# Altium schematic sheet PotsDuino.SchDoc
size A4; DocumentNumber: 1; SheetNumber: 1; SheetTotal: 2
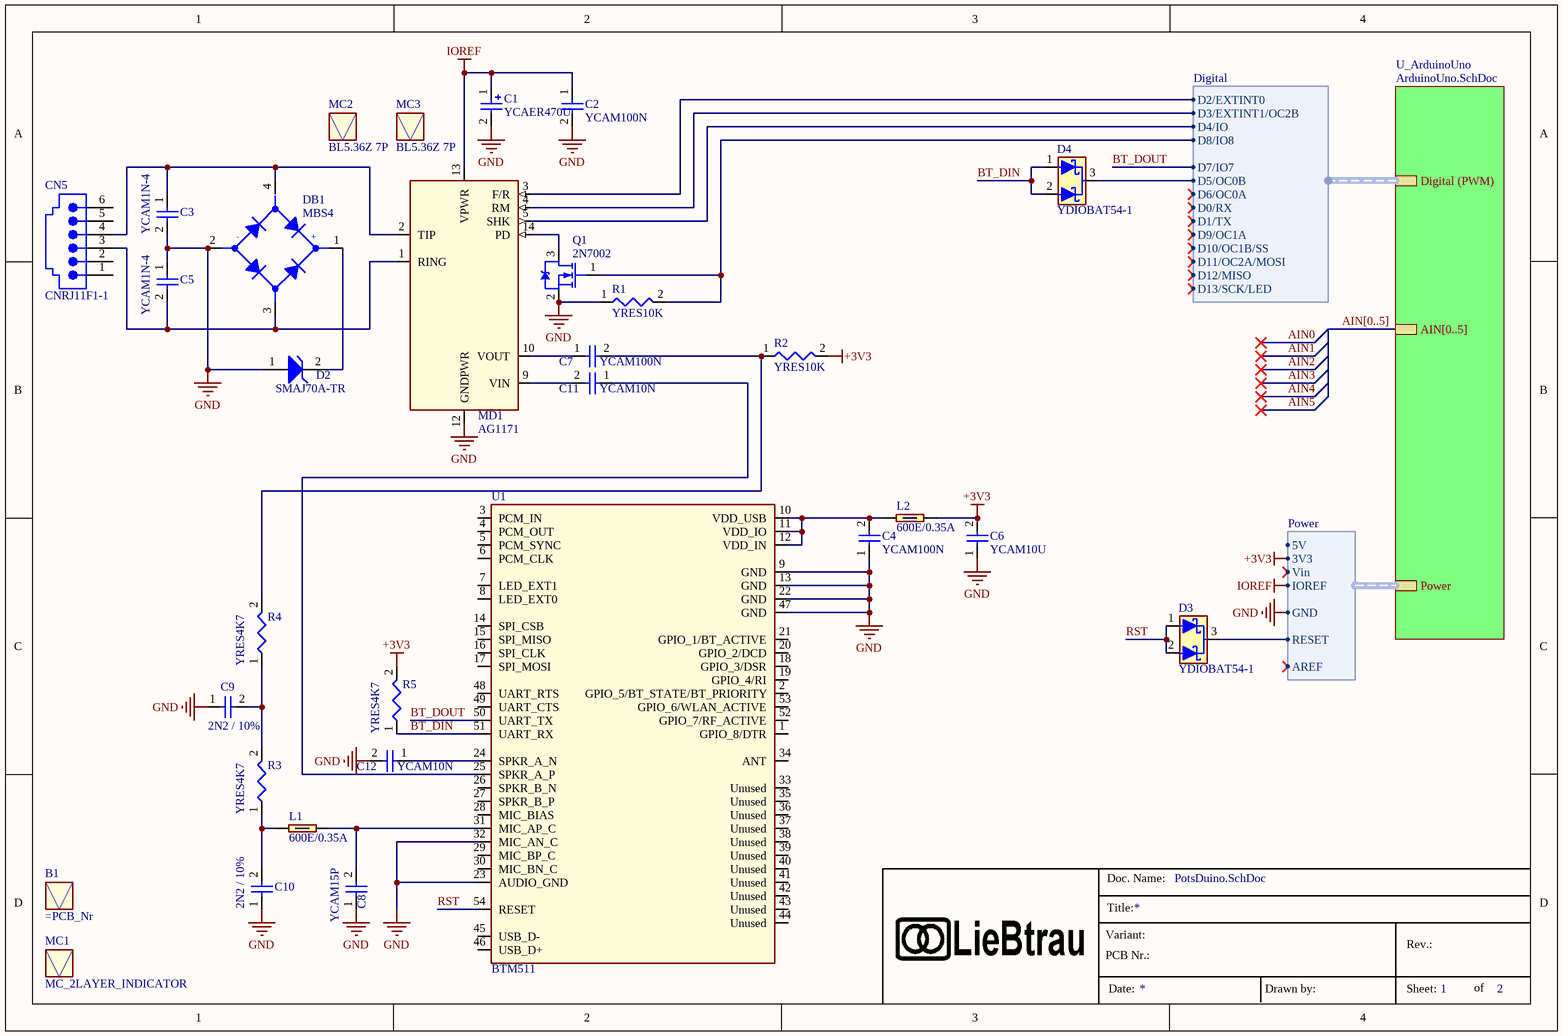
[diagram p0: PotsDuino.SchDoc]

## Parts
B1  (no value)  [MC_BoardNr]
C1  YCAER470U  [CA_CANSMD103_H100]
C2  YCAM100N  [CA_1206]
C3  YCAM1N-4  [CA_1206]
C4  YCAM100N  [CA_1206]
C5  YCAM1N-4  [CA_1206]
C6  YCAM10U  [CA_1206]
C7  YCAM100N  [CA_1206]
C8  YCAM15P  [CA_1206]
C9  2N2 / 10%  [CA_1206]
C10  2N2 / 10%  [CA_1206]
C11  YCAM10N  [CA_1206]
C12  YCAM10N  [CA_1206]
CN5  CNRJ11F1-1  [CN_MODJACK_6P]
D2  SMAJ70A-TR  [DI_DO-214AC]
D3  YDIOBAT54-1  [SC_SOT23]
D4  YDIOBAT54-1  [SC_SOT23]
DB1  MBS4  [SC_SO4]
L1  600E/0.35A  [CL_1206]
L2  600E/0.35A  [CL_1206]
MC1  MC_2LAYER_INDICATOR  [MC_2LAYER_INDICATOR]  (no BOM)
MC2  BL5.36Z 7P  [CN_TOP_ENTRY_SOCKET_7P_NOHOLES]
MC3  BL5.36Z 7P  [CN_TOP_ENTRY_SOCKET_7P_NOHOLES]
MD1  AG1171  [MD_AG1171]
Q1  2N7002  [SC_SOT23]
R1  YRES10K  [RE_1206]
R2  YRES10K  [RE_1206]
R3  YRES4K7  [RE_1206]
R4  YRES4K7  [RE_1206]
R5  YRES4K7  [RE_1206]
U1  BTM511  [SC_BTM511_BOTTOM_UP]

## Sub-sheets
U_ArduinoUno = ArduinoUno.SchDoc: Digital (PWM) (harness Digital), Power (harness Power), AIN[0..5]

## Harnesses
Power: RESET, 3V3, 5V, GND, Vin, AREF, IOREF
Digital: D0/RX, D1/TX, D2/EXTINT0, D3/EXTINT1/OC2B, D4/IO, D5/OC0B, D6/OC0A, D7/IO7, D9/OC1A, D10/OC1B/SS, D11/OC2A/MOSI, D12/MISO, D13/SCK/LED, D8/IO8

## Nets
+3V3: C6.2 L2.2 R2.2 R5.2 ; sheet U_ArduinoUno/Power.3V3
GND: C1.2 C2.2 C3.2 C4.1 C5.1 C6.1 C8.1 C9.1 C10.1 C12.2 D2.1(A) DB1.2(-DC) MD1.12(GNDPWR) Q1.2(S) R1.1 U1.9(GND) U1.13(GND) U1.22(GND) U1.23(AUDIO_GND) U1.32(MIC_AN_C) U1.47(GND) ; sheet U_ArduinoUno/Power.GND
IOREF: C1.1 C2.1 MD1.13(VPWR) ; sheet U_ArduinoUno/Power.IOREF
BT_DIN: D4.1(A1) D4.2(A2) R5.1 U1.51(UART_RX)
BT_DOUT: U1.50(UART_TX) ; sheet U_ArduinoUno/Digital (PWM).D7/IO7
RST: D3.1(A1) D3.2(A2) U1.54(RESET)
NetC3_1: C3.1 CN5.4 DB1.4(AC1) MD1.2(TIP)
NetC4_2: C4.2 L2.1 U1.10(VDD_USB) U1.11(VDD_IO) U1.12(VDD_IN)
NetC5_2: C5.2 CN5.3 DB1.3(AC2) MD1.1(RING)
NetC7_1: C7.1 MD1.10(VOUT)
NetC7_2: C7.2 R2.1 R4.2
NetC8_2: C8.2 L1.2 U1.31(MIC_AP_C)
NetC9_2: C9.2 R3.2 R4.1
NetC10_2: C10.2 L1.1 R3.1
NetC11_1: C11.1 U1.25(SPKR_A_P)
NetC11_2: C11.2 MD1.9(VIN)
NetC12_1: C12.1 U1.24(SPKR_A_N)
NetD2_2: D2.2(K) DB1.1(+DC)
NetD3_3: D3.3(C) ; sheet U_ArduinoUno/Power.RESET
NetD4_3: D4.3(C) ; sheet U_ArduinoUno/Digital (PWM).D5/OC0B
NetMD1_3: MD1.3(F/R) ; sheet U_ArduinoUno/Digital (PWM).D2/EXTINT0
NetMD1_4: MD1.4(RM) ; sheet U_ArduinoUno/Digital (PWM).D3/EXTINT1/OC2B
NetMD1_5: MD1.5(SHK) ; sheet U_ArduinoUno/Digital (PWM).D4/IO
NetMD1_14: MD1.14(PD) Q1.3(D)
NetQ1_1: Q1.1(G) R1.2 ; sheet U_ArduinoUno/Digital (PWM).D8/IO8

Not connected (* = marked no-connect by the designer): CN5 1 2 5 6; U1 1(GPIO_8/DTR) 2(GPIO_5/BT_STATE/BT_PRIORITY) 3(PCM_IN) 4(PCM_OUT) 5(PCM_SYNC) 6(PCM_CLK) 7(LED_EXT1) 8(LED_EXT0) 14(SPI_CSB) 15(SPI_MISO) 16(SPI_CLK) 17(SPI_MOSI) 18(GPIO_3/DSR) 19(GPIO_4/RI) 20(GPIO_2/DCD) 21(GPIO_1/BT_ACTIVE) 26(SPKR_B_N) 27(SPKR_B_P) 28(MIC_BIAS) 29(MIC_BP_C) 30(MIC_BN_C) 33(Unused) 34(ANT) 35(Unused) 36(Unused) 37(Unused) 38(Unused) 39(Unused) 40(Unused) 41(Unused) 42(Unused) 43(Unused) 44(Unused) 45(USB_D-) 46(USB_D+) 48(UART_RTS) 49(UART_CTS) 52(GPIO_7/RF_ACTIVE) 53(GPIO_6/WLAN_ACTIVE)

## Buses and harness runs
bus AIN[0..5] = sheet U_ArduinoUno/AIN[0..5]

## Notes on the sheet
- Title:
- Doc. Name:
- Variant:
- PCB Nr.:
- Date:
- Drawn by:
- Rev.:
- Sheet:
- of
- (in symbol MBS4) -; +

## Library data of the parts
B1 = BARE_PCB: Part Number: BARE_PCB; Order Code: =PCB_Nr
C1 = YCAER470U: Manufacturer: Panasonic; Order Code: Farnell 9693483; Part Number: YCAER470U; Component Type: capacitor
C2 C4 C7 = YCAM100N: Order Code: Farnell 1759361; Part Number: YCAM100N; Component Type: capacitor
C3 C5 = YCAM1N-4: Manufacturer: AVX; Order Code: Farnell 1855909; Part Number: YCAM1N-4; Component Type: capacitor
C6 = YCAM10U: Order Code: Farnell 1828807; Part Number: YCAM10U; Component Type: capacitor
C8 = YCAM15P: Manufacturer: Kemet; Order Code: Farnell 1800827; Part Number: YCAM15P; Component Type: capacitor
C9 C10 = MCCA001357: Manufacturer: MULTICOMP; Order Code: Farnell 1856568; Part Number: MCCA001357; Component Type: capacitor
C11 C12 = YCAM10N: Manufacturer: Multicomp; Order Code: Farnell 1759350; Part Number: YCAM10N; Component Type: capacitor
CN5 = CNRJ11F1-1: Order Code: Farnell 1536490; Part Number: CNRJ11F1-1; Component Type: connector
D2 = SMAJ70A-TR: Manufacturer: STMICROELECTRONICS; Order Code: Farnell 1749313; Part Number: SMAJ70A-TR; Component Type: zener
D3 D4 = YDIOBAT54-1: Dual Schottky Barrier Diode Common Cathode; Manufacturer: Fairchild Semiconductor; Order Code: Farnell 1467518; Part Number: YDIOBAT54-1; Component Type: diode
DB1 = MBS4: Manufacturer: TAIWAN SEMICONDUCTOR; Order Code: Farnell 4084985; Part Number: MBS4; Component Type: bridge rectifier
L1 L2 = 2512066017Y0: Ferrite Bead; Manufacturer: FAIR-RITE; Order Code: Farnell 1611982; Part Number: 2512066017Y0; Component Type: bead
MC2 MC3 = BL5.36Z 7P MECH: Manufacturer: Fischer Elektronik; Order Code: Farnell 9728910; Part Number: BL5.36Z 7P MECH; Component Type: connector
MD1 = AG1171: Manufacturer: Silvertel; Part Number: AG1171; Component Type: SLIC
Q1 = 2N7002: Order Code: Farnell 9845313RL; Part Number: 2N7002; Component Type: transistor
R1 R2 = YRES10K: Resistor; Manufacturer: Vishay Draloric; Order Code: Farnell 1469970; Part Number: YRES10K; Component Type: resistor
R3-R5 = YRES4K7: Resistor; Manufacturer: Vishay Draloric; Order Code: Farnell 1470013; Part Number: YRES4K7; Component Type: resistor
U1 = BTM511: Manufacturer: Laird Technologies; Order Code: Digikey BTM511-ND; Part Number: BTM511; Component Type: wireless
MC1 = MC_2LAYER_INDICATOR: Part Number: MC_2LAYER_INDICATOR